# EasyEDA Pro project zdiy1.eprj, board PCB1
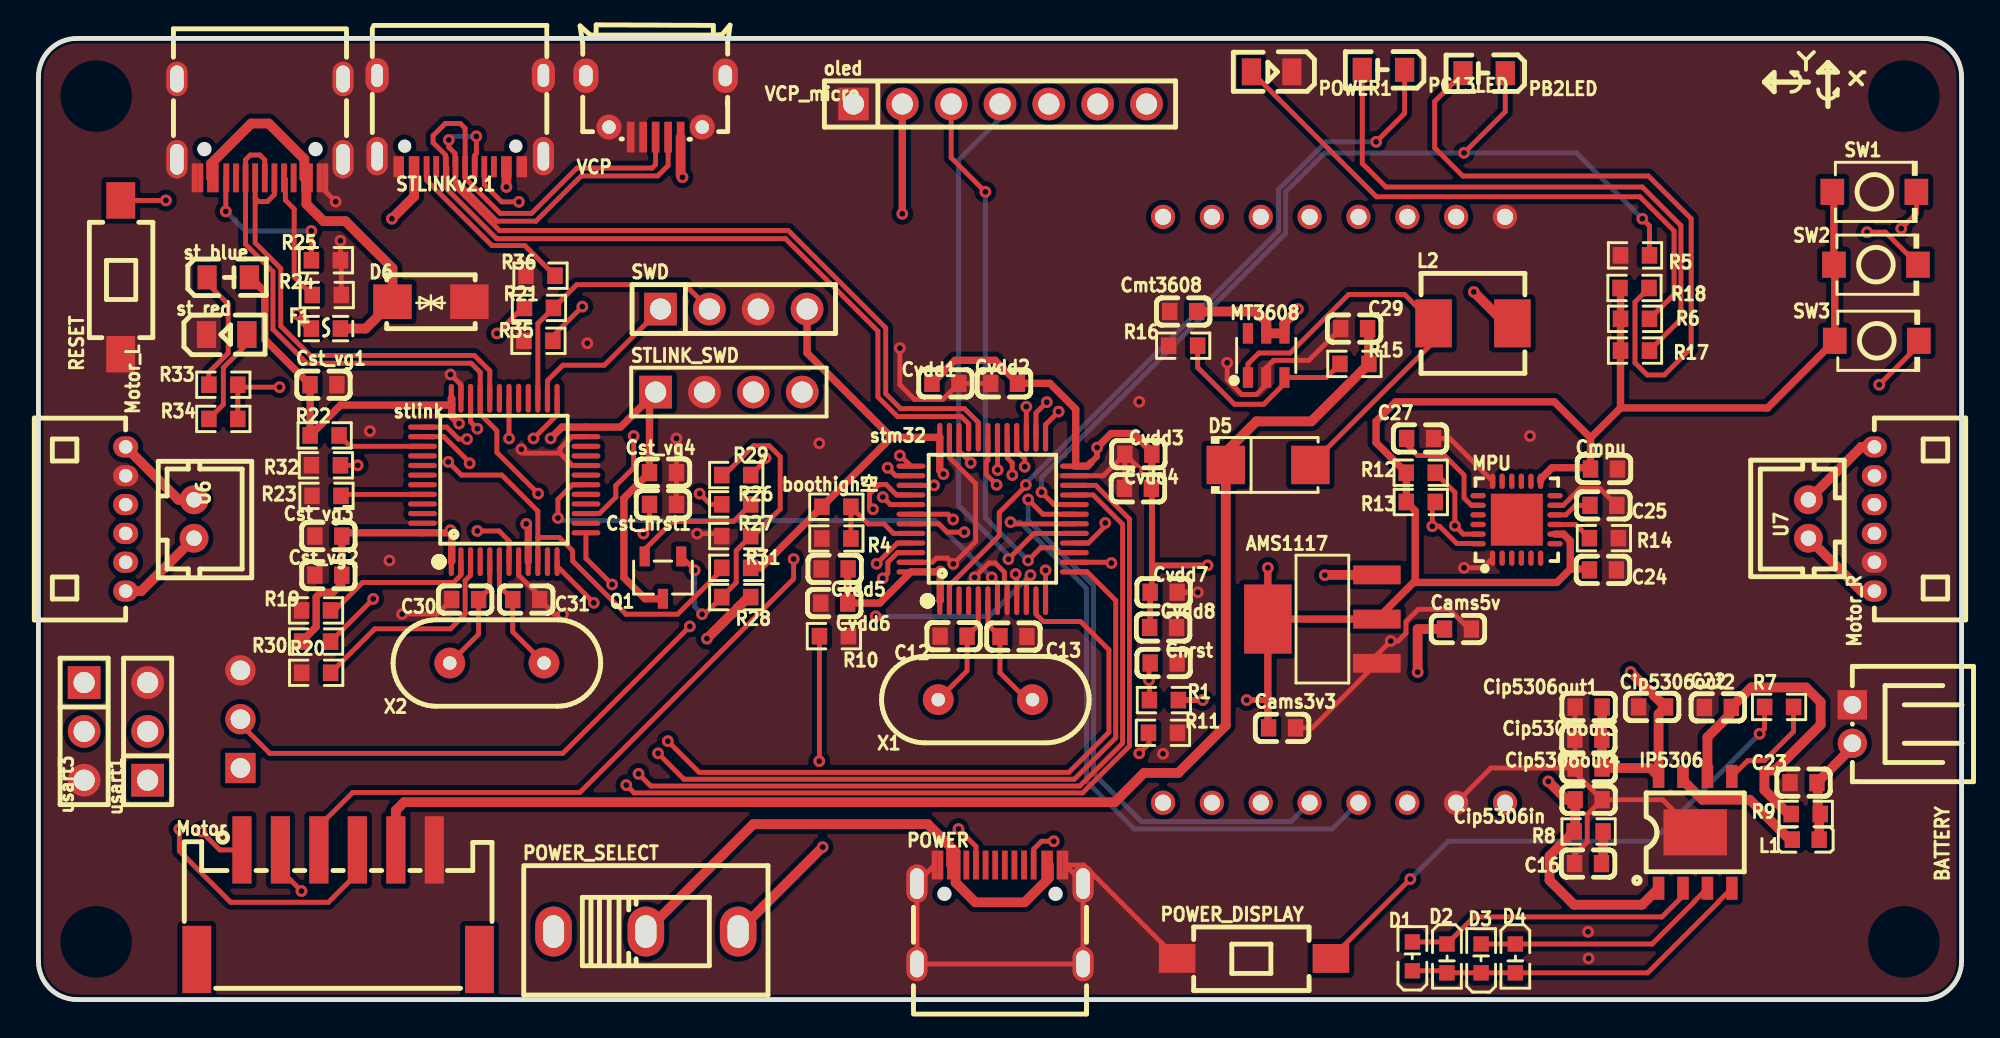
[diagram p3: board, top side]
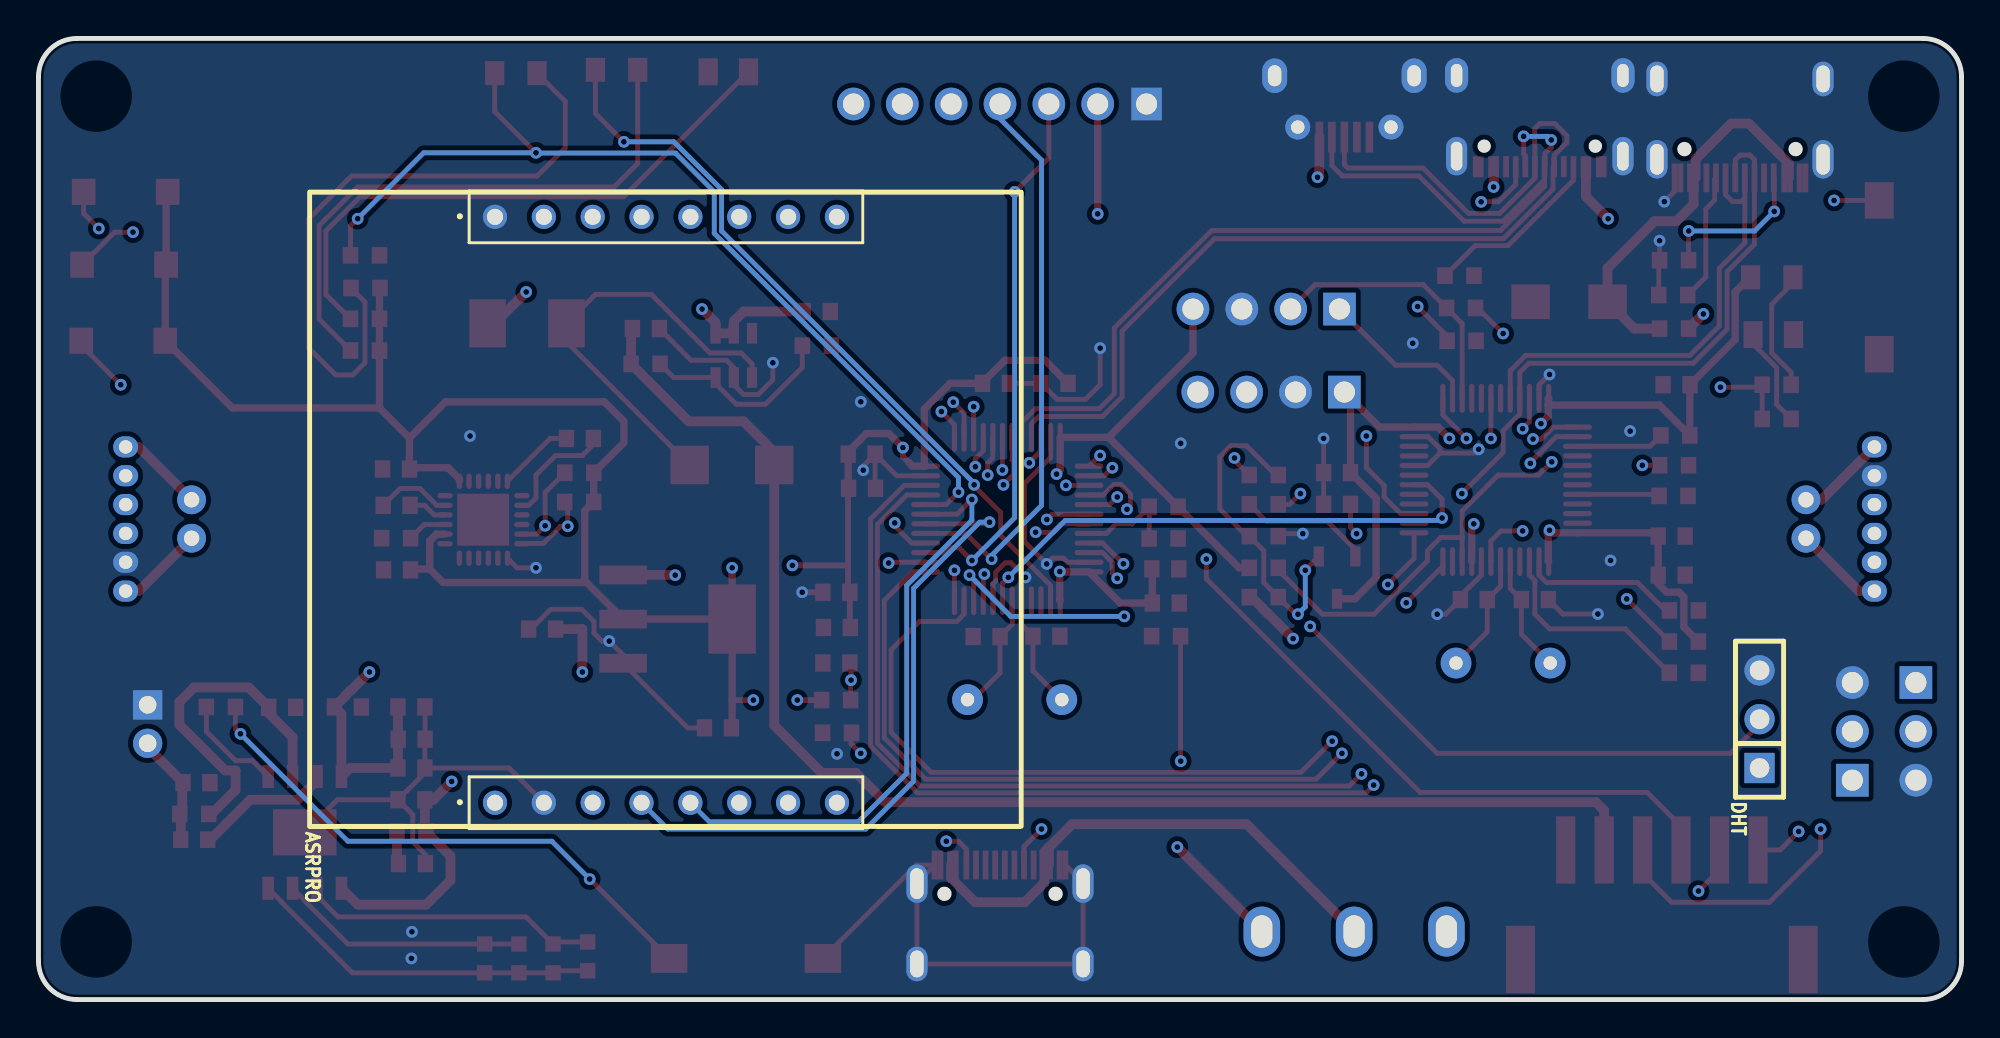
[diagram p4: board, bottom side, seen from below]

Outline 100 x 50 mm; copper layers: Top Layer, Inner1, Inner2, Bottom Layer. Coordinates in mm from the lower left corner of the outline.
Outline path: 0,48 0,2 arc(0.59,0.59) 2,0 98,0 arc(99.41,0.59) 100,2 100,48 arc(99.41,49.41) 98,50 2,50 arc(0.59,49.41) 0,48
Stack: Top Layer 0.035mm 外层铜厚1oz / Dielectric1 0.2104mm 7628 RC49% 8.6mil / Inner1 0.0152mm 内层铜厚 / Dielectric2 1.065mm 1.1mm H/HOZ Copper / Inner2 0.0152mm 内层铜厚 / Dielectric3 0.2104mm 7628 RC49% 8.6mil / Bottom Layer 0.035mm 外层铜厚1oz

## Design rules (mm)
net PA11: DP2
net PA12: DP2
template: 自定义配置
spacing copperThickness1oz (default): track to track 0.102, other pairs 0.152 to 0.3
spacing copperThickness2oz: track to track 0.203, other pairs 0.152 to 0.3
track width copperThickness1oz (default): min 0.127, default 0.254, max 2.54
track width copperThickness2oz: min 0.203, default 0.254, max 2.54
differential pair differentialPair (default): width min 0.127, default 0.254, max 2.54; gap min 0.152, default 0.152
via viaSize (default): diameter min 0.5, default 0.61, max 10; hole min 0.3, default 0.305, max 6.3
net GND uses copperRegion2
net +5V uses copperRegion2

## Placement (name value [footprint] x y rotation side)
AMS1117  AMS1117-3.3  [SOT-223-4_L6.5-W3.5-P2.30-LS7.0-BR]  66.76 19.79 0 top
ASRPRO  ASRPRO  [asrpro_fz]  67.4 25.51 90 bottom
BATTERY  WAFER-PH2.0-2PWZ  [CONN-TH_2P-P2.00_GP01-2001WR-2P]  94.32 14.33 270 top
boothigh空  10kΩ  [R0603]  41.49 25.64 180 top
C12  20pF  [C0603]  47.59 18.9 0 top
C13  20pF  [C0603]  50.7 18.88 180 top
C16  10uF  [C0603]  80.58 7.07 0 top
C22  22uF  [C0603]  87.33 15.2 0 top
C23  22uF  [C0603]  91.78 11.28 180 top
C24  10nF  [C0603]  81.35 22.35 0 top
C25  100nF  [C0603]  81.38 25.71 180 top
C27  2.2nF  [C0603]  71.84 29.19 180 top
C29  22uF  [C0603]  68.41 34.91 0 top
C30  20pF  [C0603]  22.19 20.81 0 top
C31  20pF  [C0603]  25.36 20.81 180 top
Cams3v3  2.2uF  [C0603]  64.67 14.13 0 top
Cams5v  2.2u  [C0603]  73.81 19.27 0 top
Cip5306in  10uF  [C0603]  80.61 10.39 180 top
Cip5306out1  22uF  [C0603]  80.61 15.22 180 top
Cip5306out2  22uF  [C0603]  83.91 15.22 180 top
Cip5306out3  22uF  [C0603]  80.6 13.54 180 top
Cip5306out4  22uF  [C0603]  80.61 12.05 180 top
Cmpu  100pF  [C0603]  81.41 27.6 180 top
Cmt3608  22uF  [C0603]  59.53 35.8 0 top
Cnrst  100nF  [C0603]  58.51 17.51 0 top
Cst_nrst1  100nF  [C0603]  32.47 25.76 0 top
Cst_vg1  100nF  [C0603]  14.82 31.98 0 top
Cst_vg2  100nF  [C0603]  15.08 22.08 180 top
Cst_vg3  100nF  [C0603]  15.08 24.11 180 top
Cst_vg4  100nF  [C0603]  32.47 27.41 0 top
Cvdd1  100nF  [C0603]  47.16 32.06 180 top
Cvdd2  100nF  [C0603]  50.21 32.06 0 top
Cvdd3  100nF  [C0603]  57.19 28.37 0 top
Cvdd4  100nF  [C0603]  57.17 26.6 0 top
Cvdd5  100nF  [C0603]  41.4 22.41 0 top
Cvdd6  4.7uF  [C0603]  41.38 20.63 0 top
Cvdd7  1uF  [C0603]  58.51 21.19 180 top
Cvdd8  10nF  [C0603]  58.48 19.36 0 top
D1  XL-J1608UGC-06  [LED-SMD_XL-J1608UYC-06]  71.44 2.25 270 top
D2  XL-J1608UGC-06  [LED-SMD_XL-J1608UYC-06]  73.24 2.14 90 top
D3  XL-J1608UGC-06  [LED-SMD_XL-J1608UYC-06]  75.02 2.14 270 top
D4  XL-J1608UGC-06  [LED-SMD_XL-J1608UYC-06]  76.8 2.14 90 top
D5  SS34  [SMA_L4.3-W2.6-LS5.2-RD]  63.94 27.81 0 top
D6  SMAJ6.8CA  [SMA_L4.4-W2.6-LS5.0-BI]  20.41 36.3 0 top
DHT  PM254V-11-03-H85  [HDR-TH_3P-P2.54-V-F]  10.5 14.59 90 bottom
F1  BSMD0603-050-6V  [F0603]  14.95 34.91 180 top
IP5306  IP5306  [ESOP-8_L4.9-W3.9-P1.27-LS6.0-BL-EP]  86.15 8.7 0 top
L1  1uH  [L0603]  91.9 8.32 0 top
L2  4.7uH  [IND-SMD_L5.4-W5.2_FXL0530]  74.59 35.18 0 top
Motor  WAFER-PH2.0-6PWB  [CONN-SMD_6P-P2.00_XUNPU_WAFER-PH2.0-6PWB]  15.58 4.93 0 top
Motor_L  HC-ZH1.5-6AW  [CONN-TH_6P-P1.50_HCTL_C-ZH1.5-6AW]  4.53 25 270 top
Motor_R  HC-ZH1.5-6AW  [CONN-TH_6P-P1.50_HCTL_C-ZH1.5-6AW]  95.47 25 90 top
MPU  MPU-6050  [QFN-24_L4.0-W4.0-P0.50-BL-EP2.7]  76.86 24.96 0 top
MT3608  MT3608  [SOT-23-6_L2.9-W1.6-P0.95-LS2.8-BL]  63.84 33.51 0 top
oled  PM254V-11-07-H85  [HDR-TH_7P-P2.54-V-F]  50 46.59 0 top
PB2LED  XL-2012UBC  [LED0805-RD]  75.18 48.19 180 top
PC13LED  XL-2012UBC  [LED0805-RD]  69.94 48.37 180 top
POWER  TYPE-C母座16P不绣钢  [TYPE-C-SMD_16P-EH4]  50 4.43 0 top
POWER1  NCD0805R1  [LED0805-R-RD]  64.13 48.26 180 top
POWER_DISPLAY  TS-1101-C-W  [SW-SMD_L6.0-W3.3-LS8.0]  63.21 2.14 0 top
POWER_SELECT  SS-12D10G3-G  [SW-TH_3P-L12.7-W6.7-P4.80_SS-12D10G10-G]  31.59 3.54 0 top
Q1  S8050 J3Y(RANGE:200-350)  [SOT-23-3_L3.0-W1.7-P0.95-LS2.9-BR]  32.47 21.95 90 top
R1  5.1kΩ  [R0603]  58.52 15.58 180 top
R4  4.7kΩ  [R0603]  41.49 23.98 0 top
R5  4.7kΩ  [R0603]  83.02 38.72 0 top
R6  4.7kΩ  [R0603]  83.02 35.41 0 top
R7  10kΩ  [R0603]  90.51 15.22 0 top
R8  2Ω  [R0603]  80.61 8.74 180 top
R9  500mΩ  [R0603]  91.9 9.66 0 top
R10  5.1kΩ  [R0603]  41.36 18.9 0 top
R11  5.1kΩ  [R0603]  58.47 13.88 180 top
R12  4.7kΩ  [R0603]  71.88 27.41 180 top
R13  4.7kΩ  [R0603]  71.88 25.88 180 top
R14  4.7kΩ  [R0603]  81.4 24 180 top
R15  9kΩ  [R0603]  68.43 33.07 0 top
R16  1kΩ  [R0603]  59.53 34.02 0 top
R17  4.7kΩ  [R0603]  83.02 33.76 0 top
R18  4.7kΩ  [R0603]  83 37.02 0 top
R19  10kΩ  [R0603]  14.43 20.24 0 top
R20  10kΩ  [R0603]  14.44 17 0 top
R21  100Ω  [R0603]  26.03 35.98 0 top
R22  4.7kΩ  [R0603]  14.88 29.35 180 top
R23  10kΩ  [R0603]  14.98 26.2 180 top
R24  5.1kΩ  [R0603]  14.99 36.65 0 top
R25  5.1kΩ  [R0603]  14.95 38.46 180 top
R26  1.5kΩ  [R0603]  36.28 25.76 180 top
R27  36kΩ  [R0603]  36.28 24.11 0 top
R28  10kΩ  [R0603]  36.28 20.94 0 top
R29  100Ω  [R0603]  36.28 27.29 0 top
R30  5.1kΩ  [R0603]  14.44 18.62 0 top
R31  5.1kΩ  [R0603]  36.28 22.46 180 top
R32  5.1kΩ  [R0603]  14.95 27.79 180 top
R33  510Ω  [R0603]  9.61 31.98 180 top
R34  510Ω  [R0603]  9.61 30.21 180 top
R35  5.1kΩ  [R0603]  26 34.27 0 top
R36  5.1kΩ  [R0603]  26.11 37.66 0 top
RESET  TS-1101-C-W  [SW-SMD_L6.0-W3.3-LS8.0]  4.28 37.57 90 top
st_blue  XL-2012UBC  [LED0805-RD]  9.87 37.57 0 top
st_red  NCD0805R1  [LED0805-R-RD]  9.79 34.59 0 top
stlink  STM32F103CBT6  [LQFP-48_L7.0-W7.0-P0.50-LS9.0-BL]  24.22 27.03 0 top
STLINK_SWD  IPCP254M04PB08V  [HDR-TH_4P-P2.54-V-M-1]  35.9 31.6 0 top
STLINKv2.1  TYPE-C母座16P不绣钢  [TYPE-C-SMD_16P-EH4]  11.52 45.32 180 top
stm32  STM32F103C8T6  [LQFP-48_L7.0-W7.0-P0.50-LS9.0-BL]  49.62 25 0 top
SW1  TS-1088R-02026  [SW-SMD_L3.9-W3.0-P4.45]  95.47 42.02 0 top
SW2  TS-1088R-02026  [SW-SMD_L3.9-W3.0-P4.45]  95.55 38.23 0 top
SW3  TS-1088R-02026  [SW-SMD_L3.9-W3.0-P4.45]  95.59 34.27 0 top
SWD  2.54-1*4P母  [HDR-TH_4P-P2.54-V-F]  36.16 35.92 0 top
U6  WAFER-PH2.0-2PZZ  [CONN-TH_2P-P2.00_HC-PH-2A-M]  8.09 25 270 top
U7  WAFER-PH2.0-2PZZ  [CONN-TH_2P-P2.00_HC-PH-2A-M]  92.04 25 90 top
usart1  PZ254V-11-03P  [HDR-TH_3P-P2.54-V-M]  5.68 13.95 90 top
usart3  PZ254V-11-03P  [HDR-TH_3P-P2.54-V-M]  2.38 13.95 270 top
VCP  TYPE-C 16PIN 2MD(073)  [USB-C-SMD_TYPE-C-6PIN-2MD-073]  21.93 45.7 180 top
VCP_micro  MicroXNJ  [MICRO-USB-SMD_MICROXNJ]  32.09 46.46 180 top
X1  8MHz  [OSC-TH_L10.0-W4.5-P5.00]  49.24 15.6 90 top
X2  8MHz  [OSC-TH_L10.0-W4.5-P5.00]  23.84 17.51 90 top

## Footprints (pads in the part's own frame, mm; a bottom-side part is the same pattern mirrored in y, then rotated)
asrpro_fz
  round 1.26 hole 0.84: 1(-15.269,8.861) 2(-15.269,6.321) 3(-15.269,3.781) 4(-15.269,1.241) 5(-15.269,-1.299) 6(-15.269,-3.839) 7(-15.269,-6.379) 8(-15.269,-8.919) 9(15.211,-8.919) 10(15.211,-6.379) 11(15.211,-3.839) 12(15.211,-1.299) 13(15.211,1.241) 14(15.211,3.781) 15(15.211,6.321) 16(15.211,8.861)
C0603
  rect 0.8x0.9 smd: 1(-0.7,0) 2(0.7,0)
CONN-SMD_6P-P2.00_XUNPU_WAFER-PH2.0-6PWB
  rect 1x3.5 smd: 1(-5,2.85) 2(-3,2.85) 3(-1,2.85) 4(1,2.85) 5(3,2.85) 6(5,2.85)
  rect 1.5x3.5 smd: 7(-7.35,-2.85) 8(7.35,-2.85)
CONN-TH_2P-P2.00_GP01-2001WR-2P
  rect 1.524x1.524 hole 0.914: 1(-1,0)
  round 1.524 hole 0.914: 2(1,0)
CONN-TH_2P-P2.00_HC-PH-2A-M
  round 1.5 hole 0.8: 1(-1,0) 2(1,0)
CONN-TH_6P-P1.50_HCTL_C-ZH1.5-6AW
  oval 1.1x1.3 hole 0.7: 1(-3.75,0) 2(-2.25,0) 3(-0.75,0) 4(0.75,0) 5(2.25,0) 6(3.75,0)
ESOP-8_L4.9-W3.9-P1.27-LS6.0-BL-EP
  rect 0.6x1.2 smd: 1(-1.905,-2.909) 2(-0.635,-2.909) 3(0.635,-2.909) 4(1.905,-2.909) 5(1.905,2.909) 6(0.635,2.909) 7(-0.635,2.909) 8(-1.905,2.909)
  rect 3.3x2.4 smd: 9(0,0)
F0603
  rect 0.806x0.864 smd: 1(-0.753,0) 2(0.753,0)
HDR-TH_3P-P2.54-V-F
  rect 1.575x1.575 hole 1.02: 1(-2.54,0)
  round 1.575 hole 1.02: 2(0,0) 3(2.54,0)
HDR-TH_3P-P2.54-V-M
  rect 1.7x1.7 hole 1.1: 1(-2.54,0)
  round 1.7 hole 1.1: 2(0,0) 3(2.54,0)
HDR-TH_4P-P2.54-V-F
  rect 1.7x1.7 hole 1.1: 1(-3.81,0)
  round 1.7 hole 1.1: 2(-1.27,0) 3(1.27,0) 4(3.81,0)
HDR-TH_4P-P2.54-V-M-1
  rect 1.7x1.7 hole 1.1: 1(-3.81,0)
  round 1.7 hole 1.1: 2(-1.27,0) 3(1.27,0) 4(3.81,0)
HDR-TH_7P-P2.54-V-F
  rect 1.575x1.7 hole 1.1: 1(-7.62,0)
  round 1.7 hole 1.1: 2(-5.08,0) 3(-2.54,0) 4(0,0) 5(2.54,0) 6(5.08,0) 7(7.62,0)
IND-SMD_L5.4-W5.2_FXL0530
  rect 1.9x2.5 smd: 1(-2.05,0) 2(2.05,0)
L0603
  rect 0.8x0.864 smd: 1(-0.7,0) 2(0.7,0)
LED0805-R-RD
  rect 1x1.399 smd: 1(1.05,0) 2(-1.05,0)
LED0805-RD
  rect 1x1.25 smd: 1(-1.1,0) 2(1.1,0)
LED-SMD_XL-J1608UYC-06
  rect 0.8x0.8 smd: 1(0.75,0) 2(-0.75,0)
LQFP-48_L7.0-W7.0-P0.50-LS9.0-BL
  oval 0.27x1.5 smd: 1(-2.75,-4.25) 2(-2.25,-4.25) 3(-1.75,-4.25) 4(-1.25,-4.25) 5(-0.75,-4.25) 6(-0.25,-4.25) 7(0.25,-4.25) 8(0.75,-4.25) 9(1.25,-4.25) 10(1.75,-4.25) 11(2.25,-4.25) 12(2.75,-4.25) 25(2.75,4.25) 26(2.25,4.25) 27(1.75,4.25) 28(1.25,4.25) 29(0.75,4.25) 30(0.25,4.25) 31(-0.25,4.25) 32(-0.75,4.25) 33(-1.25,4.25) 34(-1.75,4.25) 35(-2.25,4.25) 36(-2.75,4.25)
  oval 1.5x0.27 smd: 13(4.25,-2.75) 14(4.25,-2.25) 15(4.25,-1.75) 16(4.25,-1.25) 17(4.25,-0.75) 18(4.25,-0.25) 19(4.25,0.25) 20(4.25,0.75) 21(4.25,1.25) 22(4.25,1.75) 23(4.25,2.25) 24(4.25,2.75) 37(-4.25,2.75) 38(-4.25,2.25) 39(-4.25,1.75) 40(-4.25,1.25) 41(-4.25,0.75) 42(-4.25,0.25) 43(-4.25,-0.25) 44(-4.25,-0.75) 45(-4.25,-1.25) 46(-4.25,-1.75) 47(-4.25,-2.25) 48(-4.25,-2.75)
MICRO-USB-SMD_MICROXNJ
  rect 0.4x1.6 smd: 1(-1.3,1.597) 2(-0.65,1.597) 3(0,1.597) 4(0.65,1.597) 5(1.3,1.597)
  round 1.3 hole 0.7: 6(2.425,1.074) 9(-2.425,1.073)
  oval 1.3x1.8 hole 0.7x1.1: 7(3.625,-1.597) 8(-3.625,-1.597)
OSC-TH_L10.0-W4.5-P5.00
  round 1.6 hole 0.7: 1(0,2.45) 2(0,-2.45)
QFN-24_L4.0-W4.0-P0.50-BL-EP2.7
  oval 0.28x0.8 smd: 1(-1.25,-2) 2(-0.75,-2) 3(-0.25,-2) 4(0.25,-2) 5(0.75,-2) 6(1.25,-2) 13(1.25,2) 14(0.75,2) 15(0.25,2) 16(-0.25,2) 17(-0.75,2) 18(-1.242,2)
  oval 0.8x0.28 smd: 7(2,-1.25) 8(2,-0.75) 9(2,-0.25) 10(2,0.25) 11(2,0.75) 12(2,1.25) 19(-2,1.25) 20(-2,0.75) 21(-2,0.25) 22(-2,-0.25) 23(-2,-0.75) 24(-2,-1.25)
  rect 2.7x2.7 smd: 25(0.013,0)
R0603
  rect 0.806x0.864 smd: 1(-0.753,0) 2(0.753,0)
SMA_L4.3-W2.6-LS5.2-RD
  rect 2x2 smd: 1(-2.2,0) 2(2.2,0)
SMA_L4.4-W2.6-LS5.0-BI
  rect 2x1.8 smd: 1(-2,0) 2(2,0)
SOT-23-3_L3.0-W1.7-P0.95-LS2.9-BR
  rect 1.038x0.532 smd: 1(1.101,-0.95) 2(1.101,0.95) 3(-1.101,0)
SOT-23-6_L2.9-W1.6-P0.95-LS2.8-BL
  rect 0.532x1.072 smd: 1(-0.95,-1.149) 2(0,-1.149) 3(0.95,-1.149) 4(0.95,1.149) 5(0,1.149) 6(-0.95,1.149)
SOT-223-4_L6.5-W3.5-P2.30-LS7.0-BR
  rect 2.47x0.98 smd: 1(2.835,-2.3) 2(2.835,0) 3(2.835,2.3)
  rect 2.47x3.6 smd: 4(-2.835,0)
SW-SMD_L3.9-W3.0-P4.45
  rect 1.23x1.36 smd: 1(-2.185,0) 2(2.185,0)
SW-SMD_L6.0-W3.3-LS8.0
  rect 1.9x1.5 smd: 1(-4,0) 2(4,0)
SW-TH_3P-L12.7-W6.7-P4.80_SS-12D10G10-G
  oval 1.9x2.6 hole 1.1x1.7: 1(-4.8,0) 2(0,0) 3(4.8,0)
TYPE-C-SMD_16P-EH4
  oval 1.1x2 hole 0.7x1.6: 1(-4.32,1.606) 1(4.32,1.606)
  oval 1.1x1.8 hole 0.7x1.4: 1(-4.32,-2.574) 1(4.32,-2.574)
  rect 0.3x1.5 smd: A1(-3.4,2.573) A4(-2.6,2.573) A5(-1.25,2.573) A6(-0.25,2.573) A7(0.25,2.573) A8(1.25,2.574) A9(2.6,2.574) A12(3.4,2.573) B1(3.1,2.573) B4(2.3,2.574) B5(1.75,2.573) B6(0.75,2.573) B7(-0.75,2.573) B8(-1.75,2.574) B9(-2.3,2.573) B12(-3.1,2.573)
USB-C-SMD_TYPE-C-6PIN-2MD-073
  rect 0.55x1.1 smd: 1(-3.2,2.375) 2(-2.4,2.375) 11(2.4,2.375) 12(3.2,2.375)
  rect 0.3x1.1 smd: 3(-1.75,2.375) 4(-1.25,2.375) 5(-0.75,2.375) 6(-0.25,2.375) 7(0.25,2.375) 8(0.75,2.375) 9(1.25,2.375) 10(1.75,2.375)
  oval 1.1x2 hole 0.6x1.5: 13(-4.325,1.825) 14(4.325,1.825)
  oval 1.2x1.8 hole 0.6x1.2: 13(-4.325,-2.375) 14(4.325,-2.375)

## Nets
As in the schematic, except:
3V3: AMS1117.2 AMS1117.4 boothigh空.2 C24.1 Cams3v3.1 Cmpu.2 Cst_vg1.1 Cst_vg2.1 Cst_vg3.1 Cst_vg4.1 Cvdd1.2 Cvdd2.2 Cvdd3.2 Cvdd4.2 Cvdd5.2 Cvdd6.2 Cvdd7.2 Cvdd8.1 MPU.8 MPU.13 oled.2 Q1.3 R1.1 R6.1 R12.2 R13.2 R17.1 R18.1 R22.2 R30.1 R31.1 st_blue.2 stlink.1 stlink.9 stlink.24 stlink.36 stlink.48 STLINK_SWD.1 stm32.1 stm32.9 stm32.24 stm32.36 stm32.48 SW1.1 SW2.1 SW3.1 SWD.4
GND: AMS1117.1 ASRPRO.2 ASRPRO.16 BATTERY.1 C12.1 C13.1 C16.1 C22.1 C23.2 C24.2 C25.1 C27.1 C29.1 C30.1 C31.1 Cams3v3.2 Cams5v.2 Cip5306in.1 Cip5306out1.2 Cip5306out2.2 Cip5306out3.2 Cip5306out4.2 Cmpu.1 Cmt3608.1 Cnrst.2 Cst_nrst1.2 Cst_vg1.2 Cst_vg2.2 Cst_vg3.2 Cst_vg4.2 Cvdd1.1 Cvdd2.1 Cvdd3.1 Cvdd4.1 Cvdd5.1 Cvdd6.1 Cvdd7.1 Cvdd8.2 D6.2 DHT.3 IP5306.9 Motor.6 Motor_L.2 Motor_R.2 MPU.1 MPU.11 MPU.18 MT3608.2 oled.1 POWER.1 POWER.A1 POWER.A12 POWER.B1 POWER.B12 POWER1.2 POWER_DISPLAY.1 R4.1 R5.1 R10.2 R11.1 R14.1 R16.1 R19.1 R20.1 R23.2 R24.2 R25.1 R27.1 R32.2 R35.1 R36.1 RESET.1 st_red.2 stlink.8 stlink.20 stlink.23 stlink.35 stlink.47 STLINK_SWD.2 STLINKv2.1.1 STLINKv2.1.A1 STLINKv2.1.A12 STLINKv2.1.B1 STLINKv2.1.B12 stm32.8 stm32.23 stm32.35 stm32.47 SWD.3 usart1.3 usart3.3 VCP.1 VCP.12 VCP.13 VCP.14 VCP_micro.4 VCP_micro.5 VCP_micro.6 VCP_micro.7 VCP_micro.8 VCP_micro.9

Pads without a net: ASRPRO 1 3 6 7 8 9 10 13 14; Motor 7 8; MPU 2 3 4 5 6 7 12 14 15 16 17 19 21 22 25; MT3608 6; POWER A6 A7 A8 B6 B7 B8; stlink 4 11 14 16 17 19 21 22 28 29 31 40 41 42 43 45 46; STLINKv2.1 A8 B8; VCP 3 9

## Via types
v1: diameter 0.61, hole 0.305, Top Layer to Bottom Layer, 132 vias

## Routing (per net, layer and track width the routed paths; a pad name or vN(x,y) marks a point on that pad's centre or on a via; arc(x,y) is an arc through that point)
3V3: length 267.1
  Top Layer w0.254: stm32.9 50.87,22.08 v1(50.81,22.14)
  Top Layer w0.305: Cvdd8.1 57.81,19.39 Cvdd7.2 57.9,21.28 57.9,22.5 ; 57.9,22.5 57.9,26.57 Cvdd4.2 ; 57.9,22.5 57.99,22.59 v1(60.79,22.59) ; 63.93,15.6 63.91,15.58 v1(62.83,15.58) ; R1.1 v1(60.54,15.58) ; 54.73,27.93 55.05,28.25 v1(55.05,28.72)
  Top Layer w0.381: stm32.1 46.89,20.77 v1(46.89,22.27) 46.88,22.25 stm32.48 43.75,20.63 Cvdd6.2 42.08,22.38 Cvdd5.2 ; 80.71,29.22 Cmpu.2 80.64,27.67 78.7,27.67 78.11,27.08 78.11,26.96 ; 80.71,29.22 82.27,30.78 ; 80.71,29.22 78.83,31.1 70.57,31.1 69.56,30.08 69.56,28.97 R12.2 71.13,27.4 R13.2 71.59,25.42 71.59,21.78 71.5,21.7 ; 44.35,29.25 stm32.36 46.87,27.53 v1(47.06,27.34) ; 44.35,29.25 39.97,33.64 SWD.4 ; 44.35,29.25 boothigh空.2 37.56,22.46 R31.1 ; R30.1 14.44,19.38 14.44,20.94 14.69,21.19 15.33,21.19 15.78,21.64 Cst_vg2.1 Cst_vg3.1 15.95,24.28 stlink.48 21.55,24.28 21.49,24.23 21.49,22.8 stlink.1 ; v1(44.92,40.88) oled.2 ; 71.5,21.7 AMS1117.2 AMS1117.4 ; 71.5,21.7 78.96,21.7 79.65,22.4 ; stm32.24 54.55,27.75 54.73,27.93 ; 82.27,30.78 89.91,30.78 SW3.1 93.41,38.19 SW2.1 93.36,41.94 SW1.1 ; 82.27,30.78 R6.1 82.27,36.99 R18.1 ; 53.94,27.92 53.94,30.72 52.59,32.06 Cvdd2.2 50.91,32.09 49.75,33.25 47.66,33.25 Cvdd1.2 ; MPU.8 79.3,24.21 79.32,24.2 79.32,24.2 79.6,23.91 79.6,23.91 79.65,23.86 79.65,22.4 ; 31.77,31.28 30.27,29.78 stlink.24 27.22,29.78 v1(26.63,29.19) ; 31.77,31.28 Cst_vg4.1 30.44,26.08 30.44,21.95 31.54,20.85 Q1.3 ; 31.77,31.28 STLINK_SWD.1 ; Cams3v3.1 63.93,14.17 AMS1117.4 ; 79.65,22.4 80.61,22.4 C24.1 ; v1(55.05,28.72) 55.78,29.44 56.95,29.44 57.89,28.5 Cvdd3.2 57.89,26.62 Cvdd4.2 ; AMS1117.4 v1(63.93,22.46) ; 21.49,30.93 21.49,30.34 v1(21.87,29.96) ; 21.49,30.93 21.47,30.93 ; 21.49,30.93 21.49,31.26 stlink.36 21.47,30.93 ; 21.47,30.93 15.71,30.93 R22.2 14.13,31.98 Cst_vg1.1 11.77,34.33 11.77,36.81 11.01,37.57 st_blue.2 ; stlink.9 25.47,24.64 v1(25.36,24.75)
  Inner1 w0.305: v1(25.36,24.75) 26.63,26.02 v1(26.63,29.19) 25.23,30.59 22.57,30.59 21.94,29.96 v1(21.87,29.96) 20.54,28.63 20.54,25.31 v1(21.42,24.42) ; v1(55.05,28.72) 47.47,28.72 47.06,28.3 v1(47.06,27.34)
  Inner1 w0.381: v1(50.81,22.14) 49.99,21.32 47.84,21.32 v1(46.89,22.27) 46.89,25.96 47.33,26.4 47.33,27.06 v1(47.06,27.34) ; v1(63.93,22.46) 63.8,22.59 v1(60.79,22.59) ; STLINK_SWD.1 34.25,33.76 37.81,33.76 SWD.4 v1(44.92,40.88)
  Inner2 w0.305: v1(60.54,15.58) v1(62.83,15.58)
5V_IN: length 28
  Top Layer w0.508: POWER_SELECT.2 37.17,9.12 46.25,9.12 47.46,7.92 ; 52.54,7 52.54,6.32 51.29,5.06 48.72,5.06 47.69,6.08 47.69,7.68 47.46,7.92 ; 47.46,7.92 47.46,7
6V: length 72.5
  Top Layer w0.508: 69.12,34.91 69.18,34.84 R15.2 66.19,30.08 63.34,30.08 61.74,28.48 D5.1 61.74,14.26 59.27,11.79 57.49,11.79 55.97,10.27 19.01,10.27 18.58,9.84 Motor.5
+5V: length 39.3
  Top Layer w0.508: v1(33.49,42.78) 33.39,42.88 VCP_micro.1 ; 24.33,43.33 v1(24.33,42.27) ; v1(74.64,36.81) 76.27,35.18 L2.2 ; v1(18.38,40.62) 19.53,41.78 VCP.11 ; Cmt3608.2 63.34,35.8 63.84,35.29 MT3608.5 MT3608.4 64.79,35.22 v1(65.49,35.92) ; R28.2 36.92,20.94 36.34,20.36 36.34,20.34 36.1,20.1 36.08,20.1 v1(34.76,18.78) ; Cip5306out1.1 81.31,13.56 Cip5306out3.1 81.31,13.53 Cip5306out4.1 83.81,12.05 IP5306.8 84.25,14.86 Cip5306out2.1 84.01,15.81 84.01,15.84 83.78,16.08 83.75,16.08 v1(82.79,17.04) ; v1(13.42,35.67) 13.43,35.67 F1.2 ; Cams5v.1 71.73,19.27 71.72,19.26 v1(71.72,17.04) ; v1(66.89,22.08) 66.91,22.09 AMS1117.3
GND: length 131.6
  Top Layer w0.254: C25.1 81.2,26.59 80.16,26.59 79.29,25.71 MPU.11 ; v1(74.13,22.46) 75.11,22.46 MPU.1 ; Cams5v.2 74.39,19.27 73.37,20.3 71.75,20.3 71.11,19.67 71.11,19.06 70.7,18.65 v1(70.32,18.65) 69.6,17.93 69.6,17.49 66.24,14.13 Cams3v3.2 ; Cip5306out1.2 79.9,15.21 Cip5306out3.2 79.91,13.53 Cip5306out4.2 ; stlink.23 27.74,29.28 27.12,28.66 27.12,28.43 ; Cvdd3.1 57.11,27.76 v1(57.11,27.54) ; Cvdd3.1 55.37,27.25 stm32.23 ; Cvdd3.1 56.49,26.62 Cvdd4.1 ; v1(21.42,32.52) 21.63,32.31 21.64,32.31 21.88,32.07 21.88,32.06 21.97,31.97 stlink.35 ; v1(15.7,39.48) R25.1 15.74,38.42 R24.2 ; 73.72,10.24 75.53,12.05 Cip5306out4.2 ; Cvdd2.1 Cvdd1.1 47.03,31.22 45.56,31.22 44.79,31.98 v1(44.79,33.89) ; C27.1 73.39,29.19 75.62,26.96 ; v1(48.68,21.96) 49.43,22.71 49.75,22.71 50.23,22.23 50.23,21.77 50.37,21.63 stm32.8 ; stlink.20 27.77,27.78 27.12,28.43 ; Cip5306out4.2 79.91,11.8 Cip5306in.1 ; POWER_DISPLAY.1 54.35,7 POWER.A12 54.32,6.08 POWER.1 POWER.1 POWER.1 POWER.1 45.68,6.08 POWER.A1 ; v1(61.81,33.13) 61.81,32.24 62.57,31.48 63.34,31.48 63.84,31.98 MT3608.2 63.84,32.87 64.22,33.25 66.06,33.25 C29.1 ; 27.12,28.43 25.11,28.43 ; R27.1 35.4,24.24 v1(34.25,24.24) ; stm32.35 47.37,28.2 48.73,26.84 48.73,23.82 v1(47.57,22.66) 47.27,22.97 46.7,22.97 46.48,22.75 stm32.47 ; v1(15.46,41.51) 14.92,42.05 STLINKv2.1.A1 ; Cip5306in.1 84.46,10.39 IP5306.9 ; Cip5306in.1 80.54,9.62 80.54,8.2 79.88,7.54 C16.1 ; Cst_nrst1.2 Cst_vg4.2 v1(33.17,29.19) ; v1(27.27,20.05) 26.82,20.05 C31.1 26.06,21 25.62,21.44 25.61,21.44 24.97,22.08 stlink.8 ; v1(18.91,20.06) 20.73,20.06 C30.1
  Top Layer w0.305: Cvdd7.1 v1(60.29,21.19)
  vias: v1(17.23,29.57) v1(18.25,22.84) v1(25.11,28.63) v1(28.54,34.14) v1(40.6,28.94) v1(57.24,31.1) v1(58.47,12.78) v1(77.56,29.32) v1(80.58,3.53) v1(80.61,2.14)
AIN: length 26.6
  Top Layer w0.254: stlink.10 25.97,24.04 ; 25.97,24.04 27.09,24.04 27.78,23.35 27.78,22.82 30.55,20.05 33.24,20.05 35.53,22.34 R31.2 ; 25.97,24.04 25.97,25.41 24.09,27.29 22,27.29 v1(21.31,27.97) ; v1(16.6,27.79) R32.1
  Inner2 w0.254: v1(21.31,27.97) 16.78,27.97 v1(16.6,27.79)
ASRPRO_PA0: length 34.5
  Top Layer w0.254: stm32.18 53.87,24.75 50.63,24.75 v1(50.55,24.83)
  Bottom Layer w0.254: 68.64,10.24 67.27,8.87 56.99,8.87 54.5,11.36 54.5,21.39 51.06,24.83 v1(50.55,24.83)
ASRPRO_PA1: length 31.1
  Top Layer w0.254: stm32.19 52.23,25.25 v1(51.46,26.01)
  Bottom Layer w0.254: 66.1,10.24 65.11,9.25 57.37,9.25 54.85,11.77 54.85,21.55 51.46,24.93 v1(51.46,26.01)
ASRPRO_PA2: length 26.3
  Top Layer w0.254: stm32.12 v1(52.37,22.33)
  Inner1 w0.254: ASRPRO.12 65.08,40.72 61.56,37.19 61.56,34.14 52.37,24.96 v1(52.37,22.33)
ASRPRO_PA3: length 24.7
  Top Layer w0.254: stm32.39 v1(46.57,26.75)
  Inner2 w0.254: v1(46.57,26.75) 48.13,26.75 49.68,28.3 52.41,28.3 63.56,39.45 ASRPRO.11
BAT: length 5.9
  Top Layer w0.508: BATTERY.2 94.32,13.12 92.48,11.28 92.48,11.03 92.52,10.99 92.52,9.78 R9.2 92.6,9.6 L1.2
BOOT0: length 5.3
  Top Layer w0.254: R4.2 boothigh空.1 43.13,24.75 43.97,24.75 44.46,24.25 stm32.44
BOOT1: length 50.8
  Top Layer w0.254: R5.2 83.77,40.25 v1(83.4,40.62) ; stm32.20 52.81,25.75 v1(52.16,26.4) ; v1(74.13,44.05) 76.28,46.19 PB2LED.1
  Bottom Layer w0.254: v1(52.16,26.4) 52.16,27.16 64.86,39.86 64.86,42.02 66.87,44.04 74.12,44.04 v1(74.13,44.05) 79.97,44.05 v1(83.4,40.62)
DHT_DAT: length 49.4
  Top Layer w0.254: v1(50.64,27.29) 50.64,27.92 50.38,28.17 50.38,29.24 stm32.29 ; DHT.2 10.5,14.33 12.03,12.81 27.27,12.81 v1(33.87,19.41)
  Inner2 w0.254: v1(50.64,27.29) 50.64,26.72 49.48,25.56 47.21,25.56 45.46,23.81 43.01,23.81 38.62,19.41 v1(33.87,19.41)
ENCODER_LA: length 44.4
  Top Layer w0.254: stm32.40 44.62,26.25 44.07,26.8 43.71,26.8 43.22,26.3 43.22,25.69 v1(43.4,25.51)
  Inner2 w0.254: Motor_L.4 4.66,24.25 7.82,27.41 11.52,27.41 13.19,25.74 43.17,25.74 v1(43.4,25.51)
ENCODER_LB: length 42.6
  Top Layer w0.254: v1(43.9,26.14) 44.3,25.75 stm32.41
  Inner2 w0.254: Motor_L.3 4.65,25.75 6.82,27.92 11.9,27.92 12.92,26.91 43.14,26.91 v1(43.9,26.14)
ENCODER_RA: length 56.9
  Top Layer w0.254: stm32.45 44.66,23.75 v1(43.59,22.67)
  Inner2 w0.254: v1(43.58,22.67) 44.36,23.45 46.8,23.45 46.95,23.6 49.37,23.6 49.62,23.86 89.37,23.86 90.55,22.67 93.14,22.67 94.45,23.98 94.45,24.87 95.33,25.75 Motor_R.4
ENCODER_RB: length 56
  Top Layer w0.254: stm32.46 44.67,23.25 44.17,22.75 44.17,22.18 v1(43.9,21.91)
  Inner2 w0.254: Motor_R.3 95.47,24.12 93.55,22.21 90.51,22.21 89.22,23.5 49.77,23.5 49.51,23.25 47.1,23.25 46.93,23.07 45.19,23.07 44.03,21.91 v1(43.9,21.91)
IP5306_IN: length 59.3
  Top Layer w0.508: v1(78.51,11.35) 79.46,10.39 Cip5306in.2 79.91,8.8 R8.2 78.57,7.47 78.57,6.2 79.84,4.93 83.39,4.93 IP5306.1 ; 36.38,3.54 v1(40.78,7.93)
  Inner1 w0.508: v1(40.78,7.93) 44.21,11.36 69.61,11.36 70.67,12.43 77.43,12.43 v1(78.51,11.35)
L+: length 4.7
  Top Layer w0.508: U6.2 5.34,21.25 Motor_L.6
L-: length 4.7
  Top Layer w0.508: Motor_L.1 7.28,26 U6.1
L_PWM: length 48.7
  Top Layer w0.254: v1(13.68,5.65) 12.58,6.74 Motor.2 ; stm32.10 51.37,21.87 v1(51.58,22.08)
  Inner2 w0.254: v1(13.68,5.65) 29.25,5.65 v1(43.54,19.93)
  Bottom Layer w0.254: v1(43.54,19.93) 49.44,19.93 v1(51.58,22.08)
L_TURN: length 63.1
  Top Layer w0.254: stm32.13 54.53,22.25 56.02,20.76 56.02,13.62 53.86,11.46 33.56,11.46 v1(32.22,12.81) ; v1(8.47,8.74) 9.43,7.78 Motor.1
  Inner1 w0.254: v1(8.47,8.74) 10.12,10.39 14.19,10.39 16.6,12.81 v1(32.22,12.81)
NRST: length 74
  Top Layer w0.254: stm32.7 49.87,20.75 49.87,21.66 v1(49.57,21.96) ; v1(6.63,41.57) RESET.2 ; v1(27.01,25.05) 27.01,26.03 27.77,26.78 stlink.18 ; R1.2 57.77,16.6 v1(57.75,16.62) 57.75,17.44 Cnrst.1
  Inner1 w0.305: v1(6.63,41.57) 16.98,31.22 25.87,31.22 27.65,29.44 27.65,25.69 v1(27.01,25.05)
  Inner2 w0.254: v1(57.75,16.62) 57.75,17.76 55.59,19.92 51.78,19.92 49.73,21.96 v1(49.57,21.96)
  Bottom Layer w0.254: v1(49.57,21.96) 46.61,24.92 27.14,24.92 v1(27.01,25.05)
OLED_CS: length 19.9
  Top Layer w0.254: stm32.27 v1(51.37,30.84)
  Inner2 w0.254: oled.7 55.46,44.43 55.46,35.26 51.37,31.16 v1(51.37,30.84)
OLED_DC: length 22
  Top Layer w0.254: stm32.26 51.87,30.52 v1(52.43,31.08)
  Inner2 w0.254: oled.6 55.08,35.38 50.78,31.08 50.78,30.6 51.13,30.26 51.61,30.26 v1(52.43,31.08)
OLED_RES: length 23.6
  Top Layer w0.254: v1(53.05,30.59) 52.37,29.91 stm32.25
  Inner2 w0.254: v1(53.05,30.59) 52.36,29.9 50.69,29.9 50.43,30.16 50.43,31.27 54.57,35.41 54.57,43.8 52.54,45.83 oled.5
OSC_IN: length 6
  Top Layer w0.254: X1.1 48.29,17.1 48.29,18.9 48.87,19.49 stm32.5
OSC_OUT: length 6.3
  Top Layer w0.254: X1.2 51.4,15.6 50,17 50,18.88 C13.2 49.37,19.51 stm32.6
PA1: length 74.7
  Top Layer w0.254: v1(32.73,13.44) 34.35,11.82 53.58,11.82 55.66,13.9 55.66,18.19 54.19,19.67 52.25,19.67 51.87,20.05 stm32.11 ; v1(7.33,8.87) 7.33,7.73 10,5.06 15.08,5.06 16.58,6.57 Motor.4
  Inner1 w0.254: v1(32.73,13.44) 16.34,13.44 13.81,10.9 9.36,10.9 v1(7.33,8.87)
PA4: length 52.5
  Top Layer w0.254: v1(55.79,22.71) 55.75,22.75 stm32.14 ; SW1.2 97.65,40.9 v1(96.86,40.11)
  Inner1 w0.254: v1(96.86,40.11) 95.97,39.22 92.29,39.22 90.89,37.83 70.91,37.83 v1(55.79,22.71)
PA5: length 28.2
  Top Layer w0.254: v1(51.46,22.84) 52.12,23.5 52.77,23.5 53.02,23.25 stm32.15 ; oled.3 47.46,43.8 v1(49.24,42.02)
  Bottom Layer w0.254: v1(51.46,22.84) 49.24,25.06 v1(49.24,42.02)
PA6: length 51.4
  Top Layer w0.254: stm32.16 54.59,23.75 55.47,24.63 v1(55.47,24.8) ; v1(95.09,39.92) 96.04,39.92 97.73,38.23
  Inner1 w0.254: v1(95.09,39.92) 91.97,39.92 90.51,38.46 70.96,38.46 57.29,24.8 v1(55.47,24.8)
PA7: length 29.6
  Top Layer w0.254: stm32.17 51.77,24.25 v1(50.44,22.91)
  Bottom Layer w0.254: oled.4 50,45.83 47.84,43.67 47.84,25.7 50.44,23.11 v1(50.44,22.91)
PA9: length 59.3
  Top Layer w0.254: stlink.13 28.47,22.95 v1(29.83,21.59) ; stm32.30 49.87,29.25 49.87,27.55 v1(49.88,27.55)
  Inner2 w0.254: 5.68,11.41 4.55,12.54 4.55,14.6 5.17,15.22 6.31,15.22 12.66,21.57 29.81,21.57 v1(29.83,21.59) 29.85,21.57 39.71,21.57 42.66,24.52 45.16,24.52 46.92,26.27 48.15,26.27 49.43,27.55 v1(49.88,27.55)
PA10: length 55.5
  Top Layer w0.254: v1(49.82,26.78) 49.28,27.32 49.28,27.97 49.37,28.05 stm32.31 ; stlink.12 26.97,22.55 v1(28.88,20.64)
  Inner2 w0.254: usart1.2 12.37,20.64 16.7,20.64 17.13,20.22 17.61,20.22 18.03,20.64 v1(28.88,20.64) 39.29,20.64 42.81,24.16 45.31,24.16 47.06,25.91 48.96,25.91 v1(49.82,26.78)
PA11: length 55.4
  Top Layer w0.254: 21.68,42.66 VCP.7 21.66,43.35 21.66,44.02 21.34,44.34 v1(21.34,44.72) ; 21.68,42.66 21.68,42.3 23.97,40.01 38.99,40.01 44.06,34.94 44.06,31.52 44.83,30.74 48.15,30.74 48.87,30.03 stm32.32 ; 21.68,42.66 23.85,40.49 25.87,40.49 28.23,42.85 32.2,42.85 32.74,43.39 VCP_micro.2 ; VCP.5 22.69,43.34 22.69,43.93 22.77,44.01 v1(22.77,44.91)
  Bottom Layer w0.254: v1(21.34,44.72) 21.52,44.91 v1(22.77,44.91)
PA12: length 55.2
  Top Layer w0.254: stm32.33 48.37,29.95 47.99,30.33 44.67,30.33 43.65,31.35 43.65,34.78 38.84,39.58 23.86,39.58 23.84,39.6 23.8,39.6 21.28,42.13 21.28,42.16 21.24,42.2 21.24,43.27 VCP.8 21.17,43.34 21.17,43.93 20.52,44.58 20.52,44.94 21.15,45.57 21.93,45.57 22.19,45.32 22.19,43.33 VCP.6 ; 22.18,42.81 22.18,42.73 24.01,40.9 25.64,40.9 28,43.26 31.91,43.26 32.09,43.44 VCP_micro.3
PA13: length 33.2
  Top Layer w0.254: SWD.2 33.62,37.19 27.99,37.19 R21.2 25.97,35.17 stlink.27 ; v1(48.48,27.92) 48.48,27.94 47.87,28.55 stm32.34
  Inner2 w0.254: v1(48.48,27.92) 46.19,27.92 39.71,34.4 35.52,34.4 34.89,35.03 SWD.2
PA14: length 37.6
  Top Layer w0.254: v1(30.95,29.32) 30.95,27.67 30.02,26.74 30.02,26.14 29.17,25.28 stlink.15 ; v1(44.79,28.3) 44.82,28.3 stm32.37 ; stlink.26 26.47,32.2 27.27,33 29.43,33 SWD.1
  Inner2 w0.254: v1(30.95,29.32) 30.95,30.62 30.96,30.64 30.96,32.57 31.33,32.94 31.33,34.91 SWD.1 32.35,35.54 34.12,33.76 39.33,33.76 v1(44.79,28.3)
PA15: length 42.1
  Top Layer w0.254: v1(44.16,27.67) 44.57,27.25 stm32.38 ; v1(39.27,22.92) 39.27,21.89 28.16,10.78 16.34,10.78 14.71,9.14 14.71,7.91 Motor.3
  Inner2 w0.254: v1(44.16,27.67) 44.54,27.29 44.54,25.83 43.59,24.87 41.22,24.87 v1(39.27,22.92)
PB6: length 33.5
  Top Layer w0.254: stm32.42 47.29,25.25 v1(47.56,24.97) ; 72.63,27.41 73.65,26.38 v1(73.65,24.65) 74.09,24.21 MPU.23
  Inner2 w0.254: v1(73.65,24.65) 72.89,25.42 50.3,25.42 49.89,25 47.59,25 v1(47.56,24.97)
PB7: length 31.6
  Top Layer w0.254: stm32.43 46.82,24.75 47.26,24.31 v1(48.15,24.31) ; MPU.24 74.84,23.73 73.75,23.73 72.86,24.62 v1(72.48,24.62) 72.48,25.73 R13.1
  Inner2 w0.254: v1(48.15,24.31) 48.25,24.21 72.07,24.21 v1(72.48,24.62)
PB10: length 75.4
  Top Layer w0.254: stm32.21 54.85,26.25 56.38,24.72 56.38,13.34 54.15,11.11 31.84,11.11 v1(31.2,11.74)
  Inner2 w0.254: v1(31.2,11.74) 15.66,11.74 14.19,10.27 4.41,10.27 4.15,10.52 4.15,14.71 usart3.1
PB11: length 74.5
  Top Layer w0.254: stm32.22 54.98,26.75 56.73,25 56.73,13.19 54.29,10.75 30.97,10.75 v1(30.57,11.16)
  Inner2 w0.254: v1(30.57,11.16) 15.84,11.16 14.44,9.76 4.41,9.76 3.77,10.39 3.77,12.55 usart3.2
PB15: length 52
  Top Layer w0.254: SW3.2 97.78,34.04 v1(95.72,31.98) ; stm32.28 50.87,28.55 51.28,28.14 v1(51.28,27.72)
  Inner2 w0.254: v1(95.72,31.98) 90.26,26.52 52.86,26.52 52.15,27.23 51.77,27.23 v1(51.28,27.72)
PC13: length 38.9
  Top Layer w0.254: PC13LED.1 71.04,46.1 v1(69.56,44.62) ; v1(51.35,26.78) 51.35,26.72 49.96,25.34 49.96,24.14 47.37,21.54 stm32.2
  Bottom Layer w0.254: v1(69.56,44.62) 66.95,44.62 64.48,42.14 64.48,39.99 51.35,26.85 v1(51.35,26.78)
R+: length 4.6
  Top Layer w0.508: U7.2 94.79,28.75 Motor_R.6
R-: length 4.6
  Top Layer w0.508: Motor_R.1 94.79,21.25 U7.1
ST_USB+: length 40.6
  Top Layer w0.254: v1(34.38,26.32) 34.94,25.76 R26.2 ; STLINKv2.1.A6 11.77,43.68 11.52,43.94 11.01,43.94 10.77,43.69 STLINKv2.1.B6 10.77,39.29 12.19,37.87 12.19,34.87 13.96,33.1 22.5,33.1 22.97,32.63 stlink.33 22.97,30.46 23.84,29.59 23.84,28.47 v1(25.98,26.32)
  Inner2 w0.254: v1(25.98,26.32) v1(34.38,26.32)
ST_USB-: length 23.6
  Top Layer w0.254: STLINKv2.1.B7 12.27,41.88 11.9,41.51 11.46,41.51 11.27,41.7 ; 11.27,41.7 11.27,39.37 12.6,38.04 12.6,35.04 14.13,33.51 22.67,33.51 23.47,32.71 stlink.32 ; 11.27,41.7 STLINKv2.1.A7
STLINK_LED: length 19.4
  Top Layer w0.254: 10.49,31.86 10.37,31.73 R34.1 ; 10.49,31.86 R33.1 ; 10.49,31.86 v1(12.53,31.86) ; v1(24.47,29.19) 24.47,29.19 stlink.30
  Inner2 w0.254: v1(24.47,29.19) 24.47,29.83 22.44,31.86 v1(12.53,31.86)
STLINK_NRST: length 28.1
  Top Layer w0.254: Cst_nrst1.1 31.77,24.55 v1(31.46,24.24) ; v1(17.41,20.84) R30.2 ; v1(22.82,24.38) 23.95,24.38 24.47,23.86 24.47,22.79 stlink.7
  Inner1 w0.254: v1(22.82,24.38) 22.82,24.26 19.41,20.84 ; 19.41,20.84 26.54,20.84 29.81,24.11 31.33,24.11 v1(31.46,24.24) ; 19.41,20.84 v1(17.41,20.84)
STLINK_SWCLK: length 22.2
  Top Layer w0.254: stlink.37 21.23,29.78 21.85,29.16 v1(22.28,29.16)
  Inner2 w0.254: STLINK_SWD.4 35.8,27.69 23.75,27.69 v1(22.28,29.16)
STLINK_SWDIO: length 18.2
  Top Layer w0.254: v1(22.82,29.7) 22.47,30.05 stlink.34
  Inner2 w0.254: v1(22.82,29.7) 24.47,28.05 33.62,28.05 STLINK_SWD.3
USB_RENUMN: length 20.2
  Top Layer w0.254: stlink.38 21.08,29.28 22.42,27.94 v1(22.42,27.9) ; v1(37.81,28.17) 37.81,28.06 R29.2
  Inner2 w0.254: v1(37.81,28.17) 36.97,27.34 22.98,27.34 v1(22.42,27.9)
$1N940: length 9.8
  Top Layer w0.254: v1(52.79,8.24) 52.16,8.24 51.75,7.83 POWER.B5 ; v1(57.24,12.81) 57.75,13.32 57.75,13.98
  Inner2 w0.254: v1(52.79,8.24) 52.79,8.36 v1(57.24,12.81)
$1N945: length 17.5
  Top Layer w0.254: v1(47.84,8.87) 48.75,7.96 POWER.A5 ; R10.1 40.61,12.41 v1(40.6,12.4)
  Inner2 w0.254: v1(40.6,12.4) 44.13,8.87 v1(47.84,8.87)
$1N1477: length 2.1
  Top Layer w0.254: MPU.9 79.94,24.71 R14.2
$1N1848: length 2
  Top Layer w0.254: C25.2 79.92,25.71 79.42,25.21 MPU.10
$1N1890: length 6
  Top Layer w0.254: C27.2 71.14,28.88 71.72,28.3 73.11,28.3 74.13,27.29 74.13,26.09 74.51,25.71 MPU.20
$1N5535: length 22.5
  Top Layer w0.254: D5.2 72.54,34.22 L2.1 71.04,36.68 68.13,36.68 65.08,33.64 63.46,33.64 62.89,33.07 MT3608.1
$1N5567: length 10.4
  Top Layer w0.254: R16.2 60.28,32.88 62.19,30.97 63.72,30.97 64.79,32.05 MT3608.3 66.97,32.36 R15.1
$2N1682: length 12.3
  Top Layer w0.254: v1(28.28,36.05) 26.75,34.52 R35.2 ; v1(24.98,41.5) 24.08,41.5 23.18,42.4 VCP.4
  Inner2 w0.254: v1(28.28,36.05) 28.28,38.2 v1(24.98,41.5)
$2N1703: length 9.4
  Top Layer w0.254: VCP.10 20.18,42.62 23.58,39.22 25.29,39.22 R36.2
$2N4715: length 5.5
  Top Layer w0.254: IP5306.5 88.88,12.43 89.75,12.43 91.27,13.94 R7.2
$2N4720: length 28.6
  Top Layer w0.254: R7.1 89.76,14.09 v1(89.5,13.82) ; POWER_DISPLAY.2 v1(71.34,6.27)
  Bottom Layer w0.254: v1(71.34,6.27) 73.3,8.24 83.91,8.24 v1(89.5,13.82)
$2N4867: length 1.7
  Top Layer w0.508: R8.1 81.36,7.16 C16.2
$2N5169: length 15.5
  Top Layer w0.254: IP5306.2 85.52,5.4 84.42,4.3 74.65,4.3 D2.1 73.13,3 D1.2
$2N5174: length 18.5
  Top Layer w0.254: D1.1 73.13,1.5 D2.2 D3.1 D4.2 83.68,1.39 87.37,5.07 87.37,5.1 IP5306.4
$2N5218: length 13
  Top Layer w0.254: IP5306.3 86.1,5.1 86.1,5.07 83.91,2.89 D4.1 D3.2
$2N5524: length 7.2
  Top Layer w0.254: 85.52,11.37 85.59,11.37
  Top Layer w0.508: IP5306.7 85.52,11.4 86.52,10.39 88.99,10.39 91.07,8.32 L1.1
$2N5554: length 17.2
  Top Layer w0.508: IP5306.6 86.79,13.65 88.03,14.89 ; R9.1 91,9.66 89.75,10.9 89.75,11.92 90.29,11.92 92.67,14.3 92.67,15.47 91.91,16.24 89.06,16.24 C22.2
$2N9914: length 30.5
  Top Layer w0.254: 83.77,35.41 85.05,36.68 85.05,39.99 83.27,41.76 69.57,41.76 POWER1.1
$2N9917: length 34
  Top Layer w0.254: PB2LED.2 72.61,46.72 72.61,44.3 74.07,42.84 83.72,42.84 85.94,40.62 85.94,33.89 84.54,32.49 83.66,32.49 83.02,33.13 83.02,36.29 R18.2
$2N9920: length 30
  Top Layer w0.254: R17.2 85.41,35.4 85.41,40.27 83.4,42.27 70.07,42.27 68.84,43.5 PC13LED.2
$3N635: length 6.1
  Top Layer w0.254: X2.1 22.89,19.01 C30.2 23.47,21.39 stlink.5
$3N637: length 6.2
  Top Layer w0.254: stlink.6 23.97,21.5 C31.2 24.66,19.13 X2.2
$3N644: length 8.2
  Top Layer w0.254: stlink.2 21.97,22.08 21.59,21.7 16.85,21.7 15.4,20.24 R19.2
$3N649: length 11.1
  Top Layer w0.254: stlink.3 22.47,22.08 22.19,21.8 22.19,20.05 21.42,19.28 17.49,19.28 15.2,17 R20.2
$3N1080: length 10.8
  Top Layer w0.254: v1(25.74,29.19) 26.97,30.42 stlink.25 ; v1(23.84,34.65) 25.17,35.98 R21.1
  Inner2 w0.254: v1(23.84,34.65) 23.84,31.1 v1(25.74,29.19)
$3N1266: length 4.6
  Top Layer w0.254: stlink.39 16.2,28.78 R22.1
$3N1347: length 4.3
  Top Layer w0.254: stlink.44 15.81,26.28 R23.1
$3N1748: length 20.4
  Top Layer w0.508: 13.83,42.87 13.83,43.72 11.97,45.57 11.06,45.57 8.97,43.49 8.97,42.75 ; 13.83,42.75 13.93,42.64 13.93,41.38 14.82,40.49 15.96,40.49 18.41,38.05 D6.1 17.01,34.91 F1.1
$3N1993: length 6.7
  Top Layer w0.254: R24.1 13.3,37.59 13.3,41.13 12.84,41.59 12.84,42.68 STLINKv2.1.A5
$3N1997: length 8.1
  Top Layer w0.254: v1(9.74,41) 9.74,42.72 STLINKv2.1.B5 ; v1(14.19,39.99) 14.19,39.98 R25.2
  Bottom Layer w0.254: v1(9.74,41) 10.76,39.99 v1(14.19,39.99)
$3N2380: length 6.8
  Top Layer w0.254: Q1.2 31.52,23.42 32.98,24.87 36.15,24.87 R26.1
$3N2705: length 17.4
  Top Layer w0.254: R29.1 35.66,27.29 37.18,28.81 38,28.81 38.57,28.24 38.57,25.52 37.16,24.11 R27.2 36.28,23.36 36.28,21.69 R28.1 34.64,20.05 v1(34.51,20.05) ; v1(34.12,22.33) 34.12,22.35 Q1.1
  Bottom Layer w0.254: v1(34.51,20.05) 34.12,20.43 v1(34.12,22.33)
$3N3720: length 6.5
  Top Layer w0.254: R33.2 8.86,32.62 9.87,33.63 9.87,36.18 8.77,37.28 st_blue.1
$3N3725: length 5.2
  Top Layer w0.254: R34.2 9.61,30.96 9.61,32.87 10.84,34.1 st_red.1

## Copper pours and planes (outline as drawn; the poured copper is in the pictures)
+5V on Inner1: -7.4,59.54 107.15,59.54 107.15,-6.88 -7.4,-6.88
GND on Top Layer: -5.12,55.23 112.36,55.23 112.36,-7.13 -5.12,-7.13
GND on Bottom Layer: -6.77,57.77 105.12,57.77 105.12,-2.43 -6.77,-2.43
GND on Inner2: -13.5,58.66 104.48,58.66 104.48,-5.73 -13.5,-5.73
